# EAGLE design CPU Board (EAGLE 8.0.1)
CNAME: SO-DIMM CPU Module; CREVISION: V1; DESIGNER: Henrik K. B. Jensen
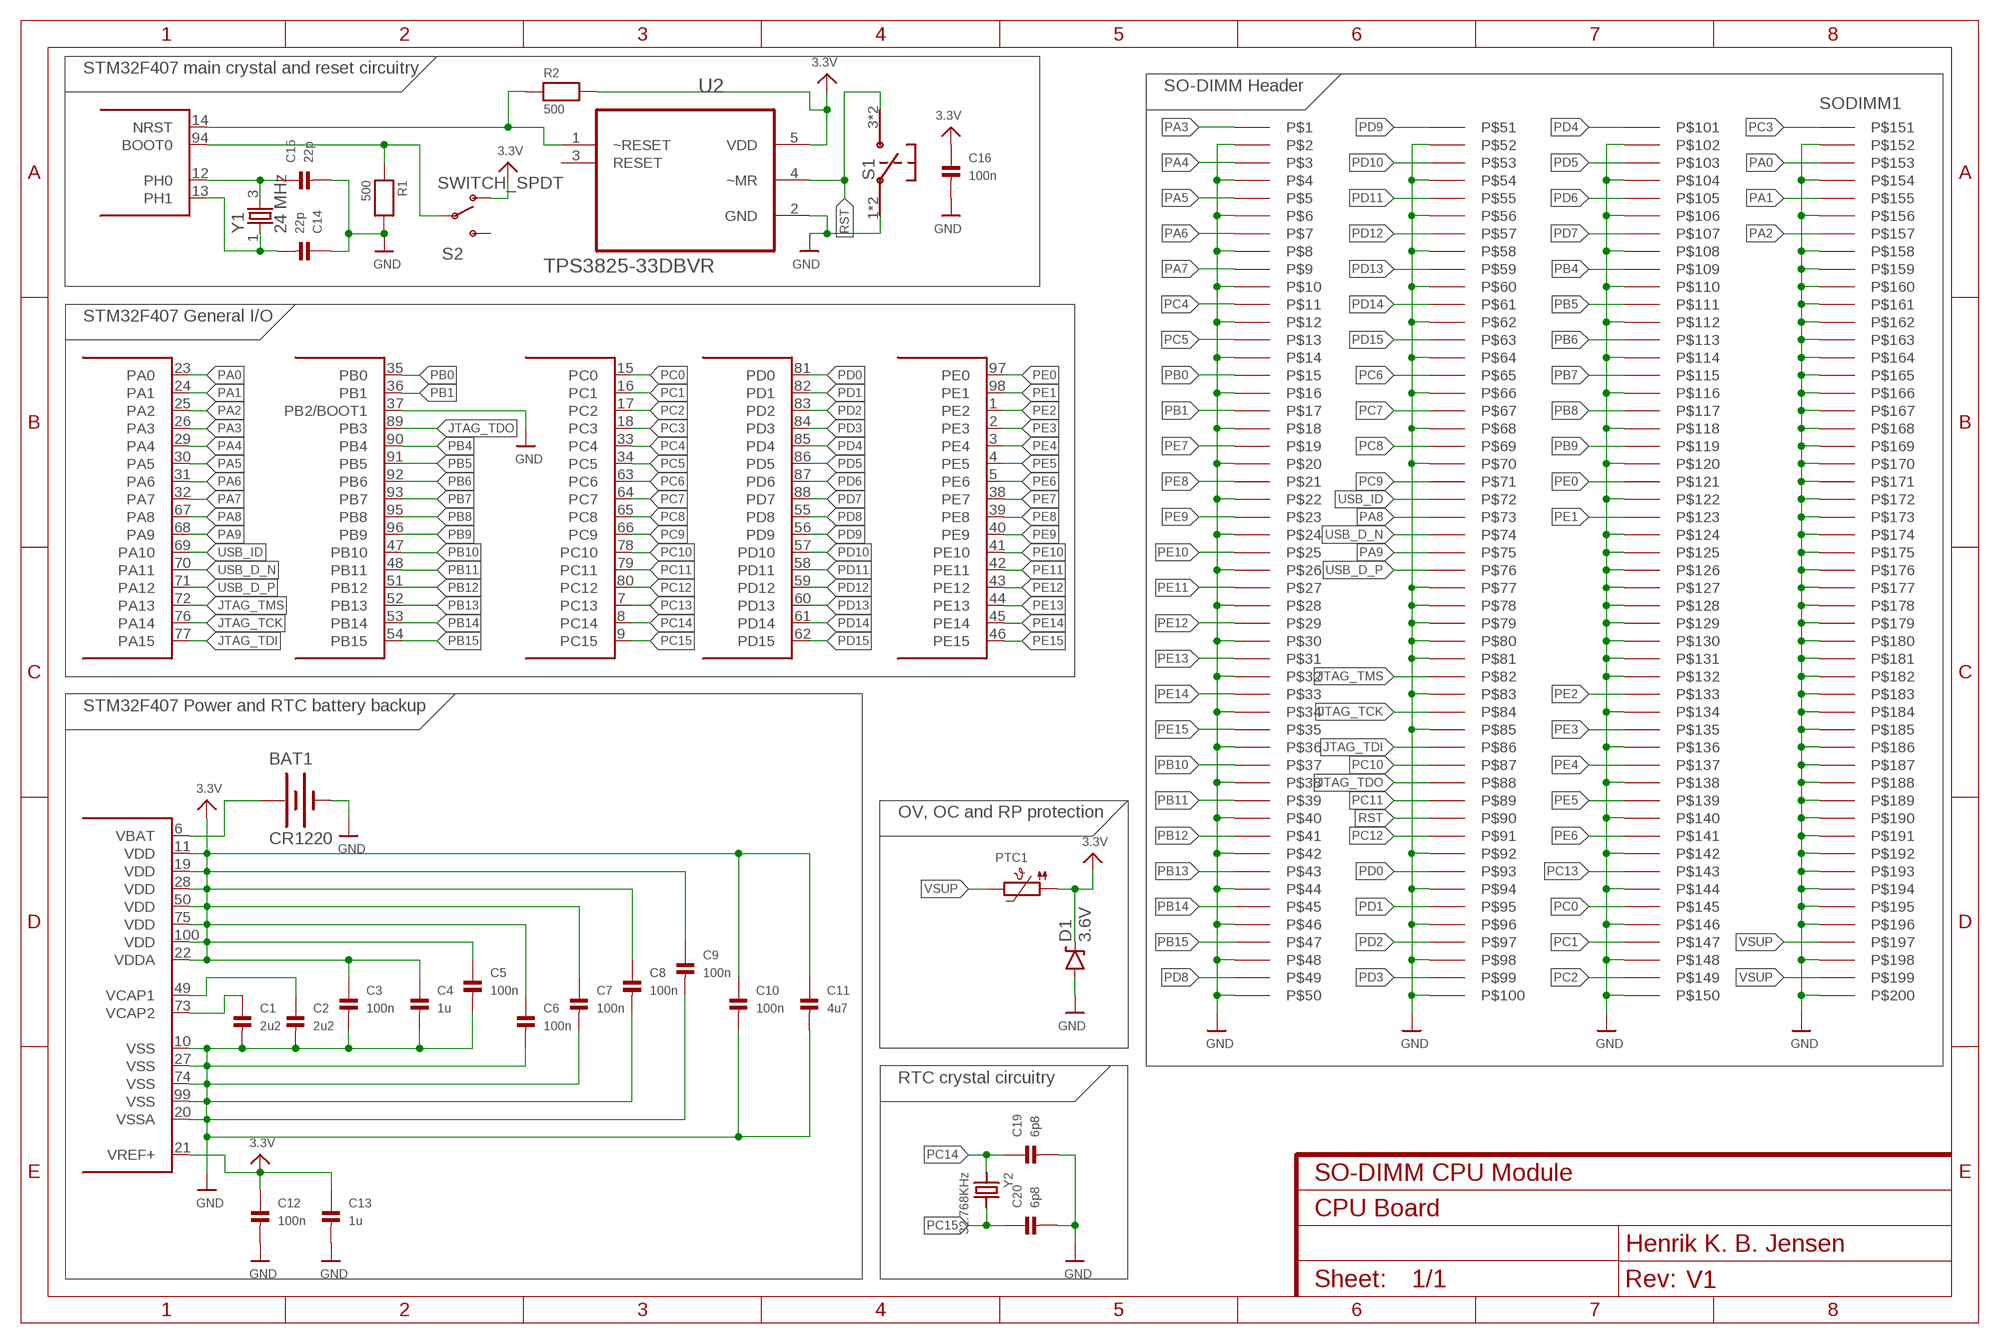
[diagram p0: schematic, sheet 1]

## Parts
BAT1  CR1220  BATTERY12PTH  [BATTCON_12MM_PTH]
C1  2u2  CAP_CERAMIC_0603  [_0603]
C2  2u2  CAP_CERAMIC_0603  [_0603]
C3  100n  CAP_CERAMIC_0603  [_0603]
C4  1u  CAP_CERAMIC_0603  [_0603]
C5  100n  CAP_CERAMIC_0603  [_0603]
C6  100n  CAP_CERAMIC_0603  [_0603]
C7  100n  CAP_CERAMIC_0603  [_0603]
C8  100n  CAP_CERAMIC_0603  [_0603]
C9  100n  CAP_CERAMIC_0603  [_0603]
C10  100n  CAP_CERAMIC_0603  [_0603]
C11  4u7  CAP_CERAMIC_0603  [_0603]
C12  100n  CAP_CERAMIC_0603  [_0603]
C13  1u  CAP_CERAMIC_0603  [_0603]
C14  22p  CAP_CERAMIC_0603  [_0603]
C15  22p  CAP_CERAMIC_0603  [_0603]
C16  100n  CAP_CERAMIC_0603  [_0603]
C19  6p8  CAP_CERAMIC_0603  [_0603]
C20  6p8  CAP_CERAMIC_0603  [_0603]
D1  3.6V  DIODE-ZENER3.3V  [SOD-323]
PTC1  PTC1206  [1206]
R1  500  RESISTOR_0603  [_0603]
R2  500  RESISTOR_0603  [_0603]
S1  PTS645SM43SMTR92  [PTS645]
S2  SWITCH_SPDT  [KPS-1290]
SODIMM1  SODIMM_BOARDSMALL  [SODIMM_BOARD_SMALLER-67.6X35]
U1  STM32F4-100  [SQFP-S-14X14-100]
U2  TPS3825-33DBVR  [SOT95P280X145-5N]
Y1  24 MHz  CRYSTAL4PIN  [CRYSTAL-4PIN]
Y2  32.768KHz  CRYSTAL32.768  [CRYSTAL_CYL_2X6MM_SMT]

## Nets
3.3V: C3.1 C4.1 C5.1 C6.1 C7.1 C8.1 C9.1 C10.1 C11.1 C12.1 C13.1 C16.1 D1.C PTC1.1 R2.2 S2.O U1.11(VDD) U1.19(VDD) U1.21(VREF+) U1.22(VDDA) U1.28(VDD) U1.50(VDD) U1.75(VDD) U1.100(VDD) U2.5(VDD)
GND: BAT1.GND(-) C1.2 C2.2 C3.2 C4.2 C5.2 C6.2 C7.2 C8.2 C9.2 C10.2 C11.2 C12.2 C13.2 C14.1 C15.2 C16.2 C19.2 C20.2 D1.A R1.2 S1.1 S1.2 SODIMM1.2 SODIMM1.4 SODIMM1.6 SODIMM1.8 SODIMM1.10 SODIMM1.12 SODIMM1.14 SODIMM1.16 SODIMM1.18 SODIMM1.20 SODIMM1.22 SODIMM1.24 SODIMM1.26 SODIMM1.28 SODIMM1.30 SODIMM1.32 SODIMM1.34 SODIMM1.36 SODIMM1.38 SODIMM1.40 SODIMM1.42 SODIMM1.44 SODIMM1.46 SODIMM1.48 SODIMM1.50 SODIMM1.52 SODIMM1.54 SODIMM1.56 SODIMM1.58 SODIMM1.60 SODIMM1.62 SODIMM1.64 SODIMM1.66 SODIMM1.68 SODIMM1.70 SODIMM1.77 SODIMM1.78 SODIMM1.79 SODIMM1.80 SODIMM1.81 SODIMM1.83 SODIMM1.85 SODIMM1.92 SODIMM1.94 SODIMM1.96 SODIMM1.98 SODIMM1.100 SODIMM1.102 SODIMM1.104 SODIMM1.106 SODIMM1.108 SODIMM1.110 SODIMM1.112 SODIMM1.114 SODIMM1.116 SODIMM1.118 SODIMM1.120 SODIMM1.122 SODIMM1.124 SODIMM1.125 SODIMM1.126 SODIMM1.127 SODIMM1.128 SODIMM1.129 SODIMM1.130 SODIMM1.131 SODIMM1.132 SODIMM1.134 SODIMM1.136 SODIMM1.138 SODIMM1.140 SODIMM1.142 SODIMM1.144 SODIMM1.146 SODIMM1.148 SODIMM1.150 SODIMM1.152 SODIMM1.154 SODIMM1.156 SODIMM1.158 SODIMM1.159 SODIMM1.160 SODIMM1.161 SODIMM1.162 SODIMM1.163 SODIMM1.164 SODIMM1.165 SODIMM1.166 SODIMM1.167 SODIMM1.168 SODIMM1.169 SODIMM1.170 SODIMM1.171 SODIMM1.172 SODIMM1.173 SODIMM1.174 SODIMM1.175 SODIMM1.176 SODIMM1.177 SODIMM1.178 SODIMM1.179 SODIMM1.180 SODIMM1.181 SODIMM1.182 SODIMM1.183 SODIMM1.184 SODIMM1.185 SODIMM1.186 SODIMM1.187 SODIMM1.188 SODIMM1.189 SODIMM1.190 SODIMM1.191 SODIMM1.192 SODIMM1.193 SODIMM1.194 SODIMM1.195 SODIMM1.196 SODIMM1.198 SODIMM1.200 U1.10(VSS) U1.20(VSSA) U1.27(VSS) U1.37(PB2/BOOT1) U1.74(VSS) U1.99(VSS) U2.2(GND)
JTAG_TCK: SODIMM1.84 U1.76(PA14)
JTAG_TDI: SODIMM1.86 U1.77(PA15)
JTAG_TDO: SODIMM1.88 U1.89(PB3)
JTAG_TMS: SODIMM1.82 U1.72(PA13)
N$1: C15.1 U1.12(PH0) Y1.3
N$2: C1.1 U1.73(VCAP2)
N$3: C2.1 U1.49(VCAP1)
N$4: R1.1 S2.P U1.94(BOOT0)
N$6: BAT1.VCC@1(+) U1.6(VBAT)
N$11: C14.2 U1.13(PH1) Y1.1
PA0: SODIMM1.153 U1.23(PA0)
PA1: SODIMM1.155 U1.24(PA1)
PA2: SODIMM1.157 U1.25(PA2)
PA3: SODIMM1.1 U1.26(PA3)
PA4: SODIMM1.3 U1.29(PA4)
PA5: SODIMM1.5 U1.30(PA5)
PA6: SODIMM1.7 U1.31(PA6)
PA7: SODIMM1.9 U1.32(PA7)
PA8: SODIMM1.73 U1.67(PA8)
PA9: SODIMM1.75 U1.68(PA9)
PB0: SODIMM1.15 U1.35(PB0)
PB1: SODIMM1.17 U1.36(PB1)
PB4: SODIMM1.109 U1.90(PB4)
PB5: SODIMM1.111 U1.91(PB5)
PB6: SODIMM1.113 U1.92(PB6)
PB7: SODIMM1.115 U1.93(PB7)
PB8: SODIMM1.117 U1.95(PB8)
PB9: SODIMM1.119 U1.96(PB9)
PB10: SODIMM1.37 U1.47(PB10)
PB11: SODIMM1.39 U1.48(PB11)
PB12: SODIMM1.41 U1.51(PB12)
PB13: SODIMM1.43 U1.52(PB13)
PB14: SODIMM1.45 U1.53(PB14)
PB15: SODIMM1.47 U1.54(PB15)
PC0: SODIMM1.145 U1.15(PC0)
PC1: SODIMM1.147 U1.16(PC1)
PC2: SODIMM1.149 U1.17(PC2)
PC3: SODIMM1.151 U1.18(PC3)
PC4: SODIMM1.11 U1.33(PC4)
PC5: SODIMM1.13 U1.34(PC5)
PC6: SODIMM1.65 U1.63(PC6)
PC7: SODIMM1.67 U1.64(PC7)
PC8: SODIMM1.69 U1.65(PC8)
PC9: SODIMM1.71 U1.66(PC9)
PC10: SODIMM1.87 U1.78(PC10)
PC11: SODIMM1.89 U1.79(PC11)
PC12: SODIMM1.91 U1.80(PC12)
PC13: SODIMM1.143 U1.7(PC13)
PC14: C19.1 U1.8(PC14) Y2.1
PC15: C20.1 U1.9(PC15) Y2.2
PD0: SODIMM1.93 U1.81(PD0)
PD1: SODIMM1.95 U1.82(PD1)
PD2: SODIMM1.97 U1.83(PD2)
PD3: SODIMM1.99 U1.84(PD3)
PD4: SODIMM1.101 U1.85(PD4)
PD5: SODIMM1.103 U1.86(PD5)
PD6: SODIMM1.105 U1.87(PD6)
PD7: SODIMM1.107 U1.88(PD7)
PD8: SODIMM1.49 U1.55(PD8)
PD9: SODIMM1.51 U1.56(PD9)
PD10: SODIMM1.53 U1.57(PD10)
PD11: SODIMM1.55 U1.58(PD11)
PD12: SODIMM1.57 U1.59(PD12)
PD13: SODIMM1.59 U1.60(PD13)
PD14: SODIMM1.61 U1.61(PD14)
PD15: SODIMM1.63 U1.62(PD15)
PE0: SODIMM1.121 U1.97(PE0)
PE1: SODIMM1.123 U1.98(PE1)
PE2: SODIMM1.133 U1.1(PE2)
PE3: SODIMM1.135 U1.2(PE3)
PE4: SODIMM1.137 U1.3(PE4)
PE5: SODIMM1.139 U1.4(PE5)
PE6: SODIMM1.141 U1.5(PE6)
PE7: SODIMM1.19 U1.38(PE7)
PE8: SODIMM1.21 U1.39(PE8)
PE9: SODIMM1.23 U1.40(PE9)
PE10: SODIMM1.25 U1.41(PE10)
PE11: SODIMM1.27 U1.42(PE11)
PE12: SODIMM1.29 U1.43(PE12)
PE13: SODIMM1.31 U1.44(PE13)
PE14: SODIMM1.33 U1.45(PE14)
PE15: SODIMM1.35 U1.46(PE15)
RESET: R2.1 U1.14(NRST) U2.1(~RESET)
RST: S1.3 S1.4 SODIMM1.90 U2.4(~MR)
USB_D_N: SODIMM1.74 U1.70(PA11)
USB_D_P: SODIMM1.76 U1.71(PA12)
USB_ID: SODIMM1.72 U1.69(PA10)
VSUP: PTC1.2 SODIMM1.197 SODIMM1.199
Unconnected: S2.S U2.3(RESET)

## Notes on the sheet
- STM32F407 main crystal and reset circuitry
- SO-DIMM Header
- STM32F407 General I/O
- STM32F407 Power and RTC battery backup
- OV, OC and RP protection
- RTC crystal circuitry

## Library data of the parts
BAT1 = SparkFun-Electromechanical:BATTERY: Battery Holders Various common sizes : AA, AAA, 18650 (PRT-12895), 20mm coin cell and 12mm coin cell. 20MM_4LEGS, BATT-10373; PROD_ID: BATT-08315
C1-C16 C19 C20 = microbuilder:CAP_CERAMIC: Ceramic Capacitors 0402 - 0402 Surface Mount Capacitors 16pF 50V 5% [Digikey: 445-4899-2-ND] 18pF 50V 5% [Digikey: 490-1281-2-ND] 22pF 50V 5% [Digikey: 490-1283-2-ND] 68pF 50V 5% [Digikey: 490-1289-2-ND] 0.1uF 10V 10% [Digikey: 490-1318-2-ND] 1.0uF 6.3V 10% [Digikey: 490-1320-2-ND] 0603 - 0603 Surface Mount Capacitors 16 pF 50V 5% [Digikey: 445-5051-2-ND] 22 pF 50V [Digikey: PCC220ACVTR-ND] 33 pF 50V 5% [Digikey: 490-1415-1-ND] 56pF 50V 5% [Digikey: 490-1421-1-ND] 220pF 50V 5% [Digikey: 445-1285-1-ND] 680 pF 50V 2200 pF 50V 5% C0G [Digikey: 445-1297-1-ND] 5600 pF 100V 5% X7R [Digikey: 478-3711-1-ND] 0.1 µF 25V 10% [Digikey: PCC2277TR-ND] 0.22 µF 16V 10% X7R [Digikey: 445-1318-1-ND] 1.0 µF 25V 10% [Digikey: 445-5146-2-ND] 0603 - RF Specific 3pF 250V +/-0.1pF RF [Digikey: 712-1347-1-ND] 18 pF 250V 5% [Digikey: 478-3505-1-ND or 712-1322-1-ND] 56 pF 250V 5% C0G RF [Digikey: 490-4867-1-ND] 68 pF 250V RF [Digikey: 490-4868-1-ND] 0805 - 0805 Surface Mount Capacitors 220 pF 250V 2% RF Ceramic Capacitor [Digikey: 712-1398-1-ND] 1000 pF 50V 2% NP0 Ceramic Capacitor [Digikey: 478-3760-1-ND] 0.1 µF 25V 10% Ceramic Capacitor [Digikey: PCC1828TR-ND] 1.0 µF 16V 10% Ceramic Capacitor[Digikey: 490-1691-2-ND] 10.0 µF 10V 10% Ceramic Capacitor[Digikey: 709-1228-1-ND] 10.0 uF 16V 10% Ceramic Capacitor [Digikey: 478-5165-2-ND] 47 uF 6.3V 20% Ceramic Capacitor [Digikey: 587-1779-1-ND or 399-5506-1-ND] 1206 - 1206 Surface Mount Capacitors 47uF 10V 20% Ceramic Capacitor [Digikey: 490-5528-1-ND or 399-5508-1-ND or 445-6010-1-ND] 100uF 6.3V -20%, +80% Y5V Ceramic Capacitor (Digikey: 490-4512-1-ND, Mouser: 81-GRM31CF50J107ZE1L)
D1 = SparkFun-DiscreteSemi:DIODE-ZENER: Zener Diode Production Part - 8199 3.4V Zener Voltage; PROD_ID: DIO-11284; VALUE: 3.3V
PTC1 = microbuilder:PTC: PTC (Resettable Fuse) 1206 Package 250mA PTC (16V Max, Time-to-Trip: 0.08s) - Digikey: F2110CT-ND 1210 Package 100mA PTC (30V Max, Time-to-Trip: 0.6s) - Digikey: MF-USMF010-2CT-ND 1812 Package 750mA PTC (24V Max, Time-to-Trip: 0.2s) - Digikey: MF-MSMF075/24-2CT-ND
R1 R2 = microbuilder:RESISTOR: Resistors 0402 - 0402 Surface Mount Package 22 Ohm 1% 1/16W [Digikey: 311-22.0LRTR-ND] 33 Ohm 5% 1/16W 1.0K 5% 1/16W 1.5K 5% 1/16W 2.0K 1% 1/16W 10.0K 1% 1/16W [Digikey: 311-10.0KLRTR-ND] 10.0K 5% 1/16W [Digikey: RMCF0402JT10K0TR-ND] 12.1K 1% 1/16W [Digikey: 311-22.0LRTR-ND] 100.0K 5% 1/16W 0603 - 0603 Surface Mount Package 0 Ohm 1/10 Watt 1% Resistor 15 Ohm 1/10 Watt 1% Resistor 33 Ohm 1/10 Watt 1% Resistor 49.9 Ohm 1/10 Watt 1% Resistor 100 Ohm 1/10 Watt 1% Resistor 150 Ohm 1/10 Watt 1% Resistor 240 Ohm 1/10 Watt 1% Resistor 390 Ohm 1/10 Watt 1% Resistor 560 Ohm 1/10 Watt 1% Resistor 680 Ohm 1/10 Watt 1% Resistor 750 Ohm 1/10 Watt 1% Resistor 1.0K Ohm 1/10 Watt 1% Resistor 1.5K Ohm 1/10 Watt 1% Resistor 2.0K Ohm 1/10 Watt 1% Resistor 2.2K Ohm 1/10 Watt 1% Resistor 3.3K Ohm 1/10 Watt 1% Resistor 4.7K Ohm 1/10 Watt 1% Resistor 10.0K Ohm 1/10 Watt 1% Resistor 12.0K Ohm 1/10 Watt 1% Resistor 12.1K Ohm 1/10 Watt 1% Resistor 20.0K Ohm 1/10 Watt 1% Resistor 33.0K Ohm 1/10 Watt 1% Resistor 100.0K Ohm 1/10 Watt 1% Resistor 0805 - 0805 Surface Mount Package 0 Ohm 1/8 Watt 1% Resistor 33 Ohm 1/8 Watt 1% Resistor 100 Ohm 1/8 Watt 1% Resistor 150 Ohm 1/8 Watt 1% Resistor 200 Ohm 1/8 Watt 1% Resistor 240 Ohm 1/8 Watt 1% Resistor 330 Ohm 1/8 Watt 1% Resistor 390 Ohm 1/8 Watt 1% Resistor 470 Ohm 1/8 Watt 1% Resistor 1.0K Ohm 1/8 Watt 1% Resistor 1.5K Ohm 1/8 Watt 1% Resistor 2.0K Ohm 1/8 Watt 1% Resistor 4.7K Ohm 1/8 Watt 1% Resistor 5.1K Ohm 1/8 Watt 1% Resistor 5.6K Ohm 1/8 Watt 1% Resistor 10.0K Ohm 1/8 Watt 1% Resistor 22.0K Ohm 1/8 Watt 1% Resistor 33.0K Ohm 1/8 Watt 1% Resistor 100K Ohm 1/8 Watt 1% Resistor 1206 - 1206 Surface Mount Package 2012 - 2010 Surface Mount Package 0.11 Ohm 1/2 Watt 1% Resistor - Digikey: RHM.11UCT-ND
S1 = switches:PTS645SM43SMTR92: Tactile Switch SPST-NO Top Actuated Surface Mount; DIGIKEY: CKN9112CT-ND
S2 = SparkFun-Electromechanical:SWITCH_SPDT: SWCH-10651 Side-actuated SPDT slide switch, as used on the Arduino Pro; PROD_ID: SWCH-10651
SODIMM1 = BaseApp:SODIMM_BOARD: SODIMM BOARD Thickness of board must be 1mm.
U1 = apbteam_stm32:STM32F4-100: STM32F4, 100 pin package According to STM32F40x datasheet, almost compatible with STM32F4xx, STM32F2xx, some pins must be connected differently, see chapter 2.1.
U2 = Texas Instruments_By_element14_Batch_1:TPS3825-33DBVR: PROCESSOR SUPERVISORY CIRCUITS; MPN: TPS3825-33DBVR; OC_FARNELL: 1535758; OC_NEWARK: 77C0425; PACKAGE: SOT-23-5; SUPPLIER: Texas Instruments
Y1 = BaseApp:CRYSTAL: CRYSTAL SMD-10.5X4.8-2PIN :- http://www.digikey.com/product-detail/en/CX49GFNB12000H0PESZZ/478-4349-1-ND/1532102 SMD-5X3- 4PIN :- 535-11281-1-ND
Y2 = microbuilder:CRYSTAL: Crystals HC49UP - Surface Mount Crystal 4.0MHz 18pF +/-30ppm Surface Mount Crystal [Digikey: 535-9857-1-ND] 12.0 MHz Surface Mount Crystal [Digikey: 535-9869-6-ND] 25.0 MHz Surface Mount Crystal [Digikey: 535-9078-1-ND] 2.5 x 2.0mm - MEMs SMT Crystal 16.0 MHz 10pF 20ppm 2.5 x 2.0mm Crystal [Digikey -40-85°C: 535-10923-1-ND] 3.2 x 2.5mm - MEMs SMT Crystal 12.0 MHz 8pF 15ppm 3.2 x 2.5mm Crystal [Digikey: -10-70°C: 644-1047-1-ND -40-125°C: 644-1128-1-ND] 16.0 MHz 8pF 15ppm 3.2 x 2.5mm Crystal [Digikey: -10-70°C: 644-1049-1-ND -40-125°C: 644-1129-2-ND] 16.0 MHz 10pF 10ppm 3.2 x 2.5mm Crystal [Digikey: 644-1100-1-ND] 27.12 MHz 18pF 30ppm 3.2 x 2.5mm Crystal [Digikey: 887-1424-1-ND] 27.12MHz 10pF 10ppm 3.2 x 2.5mm Crystal [Digikey: 887-1329-1-ND] 4.9 x 1.8mm - MEMs SMT Crystal 32.768 KHz 12.5pF 20ppm 4.9 x 1.8mm Crystal [Digikey: SE2415CT-ND] 8.0 x 3.8mm - Surface Mount Crystal 32.768kHz 12.5pF 20ppm -40°C-85°C [Digikey: 535-9166-2-ND] Cylinder 32.768KHz Cylinder Crystal (2x6mm body) [Ex. Digikey: 300-8341-2-ND]

## Board
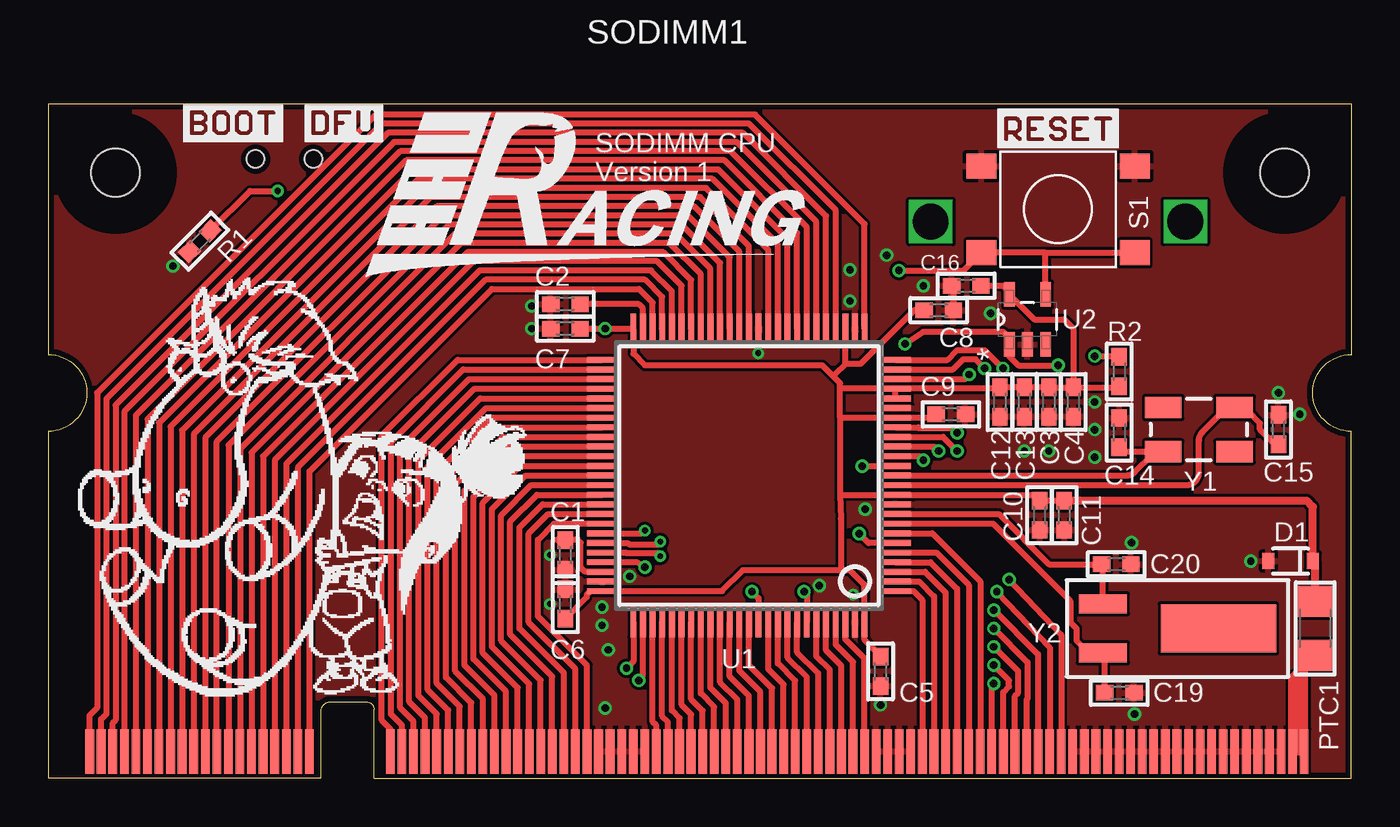
[diagram p1: board, top side]
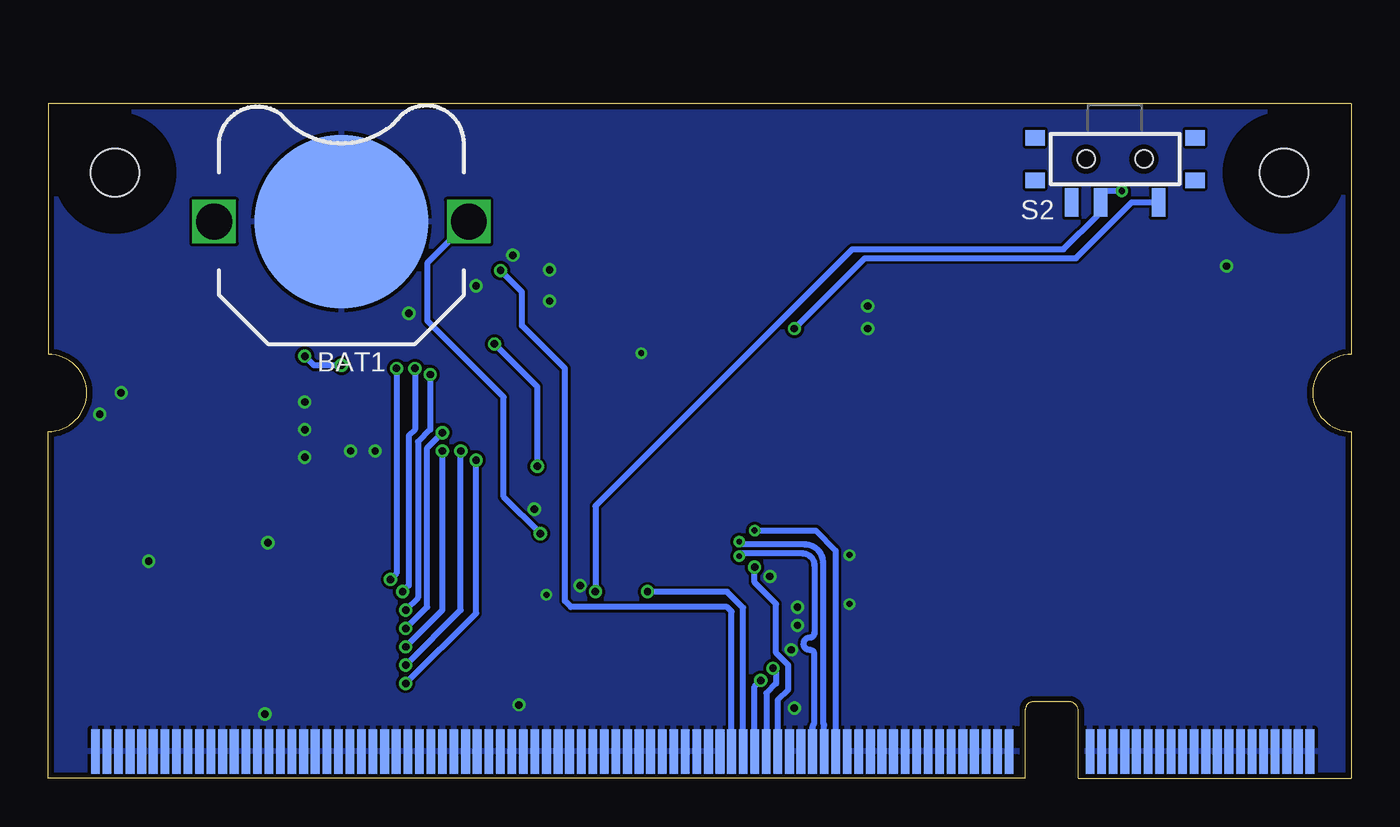
[diagram p2: board, bottom side, seen from below]

Size 67.6 x 35 mm. Coordinates in mm from the lower left corner, seen from the top.
Copper layers (1*16): Top 0.035mm / dielectric 1.5mm / Bottom 0.035mm
Design rules "PCB-POOL Standard": minimum track width 0.15mm, minimum drill 0.3mm, track to track 0.15mm, track to pad 0.15mm, pad to pad 0.15mm, via to via 0.15mm, smd to smd 0.15mm, copper to edge 0.3mm, drill to drill 0.2mm, minimum pad ring 0.2mm, minimum via ring 0.15mm, stop-mask expansion 0.075mm, vias tented up to drill 0mil, thermal gap 0.2mm
Holes 2.5 mm at 3.49,31.43 64.14,31.43
tKeepout: area 0.5,28.4 to 6.5,34.4; area 61.1,28.4 to 67.2,34.4
bKeepout: area 0.5,28.4 to 6.5,34.4; area 61.1,28.4 to 67.2,34.4
tRestrict: area 0.5,28.4 to 6.5,34.5; area 61.1,28.4 to 67.2,34.5
bRestrict: area 0.5,28.4 to 6.5,34.5; area 61.1,28.4 to 67.2,34.5

### Footprints (pad centres in the part's own frame; a part is rotated, then mirrored left to right if it is on the bottom)
BATTCON_12MM_PTH = smd 9 x 9: GND 0,0 | drill 1.854 square: VCC@1 6.604,0; VCC@2 -6.604,0
_0603 = smd 0.9 x 0.8: 1 -0.762,0; 2 0.762,0
SOD-323 = smd 0.63 x 0.83: A 1.15,0; C -1.15,0
1206 = smd 1.6 x 1.8: 1 -1.4,0; 2 1.4,0
PTS645 = smd 1.55 x 1.3: 1 -3.975,2.25; 2 3.975,2.25; 3 3.975,-2.25; 4 -3.975,-2.25
KPS-1290 = smd 0.7 x 1.5: O -2.25,2.25; P 0.75,2.25; S 2.25,2.25 | smd 1 x 0.8: P$1 -4.15,1.1; P$2 -4.15,-1.1; P$3 4.15,-1.1; P$4 4.15,1.1 | hole 0.9: -1.5,0; 1.5,0
SODIMM_BOARD_SMALLER-67.6X35 = smd 0.45 x 2.3: 1 2.15,1.4; 3 2.75,1.4; 5 3.35,1.4; 7 3.95,1.4; 9 4.55,1.4; 11 5.15,1.4; 13 5.75,1.4; 15 6.35,1.4; 17 6.95,1.4; 19 7.55,1.4; 21 8.15,1.4; 23 8.75,1.4; 25 9.35,1.4; 27 9.95,1.4; 29 10.55,1.4; 31 11.15,1.4; 33 11.75,1.4; 35 12.35,1.4; 37 12.95,1.4; 39 13.55,1.4; 41 17.75,1.4; 43 18.35,1.4; 45 18.95,1.4; 47 19.55,1.4; 49 20.15,1.4; 51 20.75,1.4; 53 21.35,1.4; 55 21.95,1.4; 57 22.55,1.4; 59 23.15,1.4; 61 23.75,1.4; 63 24.35,1.4; 65 24.95,1.4; 67 25.55,1.4; 69 26.15,1.4; 71 26.75,1.4; 73 27.35,1.4; 75 27.95,1.4; 77 28.55,1.4; 79 29.15,1.4; 81 29.75,1.4; 83 30.35,1.4; 85 30.95,1.4; 87 31.55,1.4; 89 32.15,1.4; 91 32.75,1.4; 93 33.35,1.4; 95 33.95,1.4; 97 34.55,1.4; 99 35.15,1.4; 101 35.75,1.4; 103 36.35,1.4; 105 36.95,1.4; 107 37.55,1.4; 109 38.15,1.4; 111 38.75,1.4; 113 39.35,1.4; 115 39.95,1.4; 117 40.55,1.4; 119 41.15,1.4; 121 41.75,1.4; 123 42.35,1.4; 125 42.95,1.4; 127 43.55,1.4; 129 44.15,1.4; 131 44.75,1.4; 133 45.35,1.4; 135 45.95,1.4; 137 46.55,1.4; 139 47.15,1.4; 141 47.75,1.4; 143 48.35,1.4; 145 48.95,1.4; 147 49.55,1.4; 149 50.15,1.4; 151 50.75,1.4; 153 51.35,1.4; 155 51.95,1.4; 157 52.55,1.4; 159 53.15,1.4; 161 53.75,1.4; 163 54.35,1.4; 165 54.95,1.4; 167 55.55,1.4; 169 56.15,1.4; 171 56.75,1.4; 173 57.35,1.4; 175 57.95,1.4; 177 58.55,1.4; 179 59.15,1.4; 181 59.75,1.4; 183 60.35,1.4; 185 60.95,1.4; 187 61.55,1.4; 189 62.15,1.4; 191 62.75,1.4; 193 63.35,1.4; 195 63.95,1.4; 197 64.55,1.4; 199 65.15,1.4 | smd 0.45 x 2.3 bottom: 2 2.15,1.4; 4 2.75,1.4; 6 3.35,1.4; 8 3.95,1.4; 10 4.55,1.4; 12 5.15,1.4; 14 5.75,1.4; 16 6.35,1.4; 18 6.95,1.4; 20 7.55,1.4; 22 8.15,1.4; 24 8.75,1.4; 26 9.35,1.4; 28 9.95,1.4; 30 10.55,1.4; 32 11.15,1.4; 34 11.75,1.4; 36 12.35,1.4; 38 12.95,1.4; 40 13.55,1.4; 42 17.75,1.4; 44 18.35,1.4; 46 18.95,1.4; 48 19.55,1.4; 50 20.15,1.4; 52 20.75,1.4; 54 21.35,1.4; 56 21.95,1.4; 58 22.55,1.4; 60 23.15,1.4; 62 23.75,1.4; 64 24.35,1.4; 66 24.95,1.4; 68 25.55,1.4; 70 26.15,1.4; 72 26.75,1.4; 74 27.35,1.4; 76 27.95,1.4; 78 28.55,1.4; 80 29.15,1.4; 82 29.75,1.4; 84 30.35,1.4; 86 30.95,1.4; 88 31.55,1.4; 90 32.15,1.4; 92 32.75,1.4; 94 33.35,1.4; 96 33.95,1.4; 98 34.55,1.4; 100 35.15,1.4; 102 35.75,1.4; 104 36.35,1.4; 106 36.95,1.4; 108 37.55,1.4; 110 38.15,1.4; 112 38.75,1.4; 114 39.35,1.4; 116 39.95,1.4; 118 40.55,1.4; 120 41.15,1.4; 122 41.75,1.4; 124 42.35,1.4; 126 42.95,1.4; 128 43.55,1.4; 130 44.15,1.4; 132 44.75,1.4; 134 45.35,1.4; 136 45.95,1.4; 138 46.55,1.4; 140 47.15,1.4; 142 47.75,1.4; 144 48.35,1.4; 146 48.95,1.4; 148 49.55,1.4; 150 50.15,1.4; 152 50.75,1.4; 154 51.35,1.4; 156 51.95,1.4; 158 52.55,1.4; 160 53.15,1.4; 162 53.75,1.4; 164 54.35,1.4; 166 54.95,1.4; 168 55.55,1.4; 170 56.15,1.4; 172 56.75,1.4; 174 57.35,1.4; 176 57.95,1.4; 178 58.55,1.4; 180 59.15,1.4; 182 59.75,1.4; 184 60.35,1.4; 186 60.95,1.4; 188 61.55,1.4; 190 62.15,1.4; 192 62.75,1.4; 194 63.35,1.4; 196 63.95,1.4; 198 64.55,1.4; 200 65.15,1.4
SQFP-S-14X14-100 = smd 0.3 x 1.6: 1 -6,-7.6; 2 -5.5,-7.6; 3 -5,-7.6; 4 -4.5,-7.6; 5 -4,-7.6; 6 -3.5,-7.6; 7 -3,-7.6; 8 -2.5,-7.6; 9 -2,-7.6; 10 -1.5,-7.6; 11 -1,-7.6; 12 -0.5,-7.6; 13 0,-7.6; 14 0.5,-7.6; 15 1,-7.6; 16 1.5,-7.6; 17 2,-7.6; 18 2.5,-7.6; 19 3,-7.6; 20 3.5,-7.6; 21 4,-7.6; 22 4.5,-7.6; 23 5,-7.6; 24 5.5,-7.6; 25 6,-7.6; 51 6,7.6; 52 5.5,7.6; 53 5,7.6; 54 4.5,7.6; 55 4,7.6; 56 3.5,7.6; 57 3,7.6; 58 2.5,7.6; 59 2,7.6; 60 1.5,7.6; 61 1,7.6; 62 0.5,7.6; 63 0,7.6; 64 -0.5,7.6; 65 -1,7.6; 66 -1.5,7.6; 67 -2,7.6; 68 -2.5,7.6; 69 -3,7.6; 70 -3.5,7.6; 71 -4,7.6; 72 -4.5,7.6; 73 -5,7.6; 74 -5.5,7.6; 75 -6,7.6 | smd 1.6 x 0.3: 26 7.6,-6; 27 7.6,-5.5; 28 7.6,-5; 29 7.6,-4.5; 30 7.6,-4; 31 7.6,-3.5; 32 7.6,-3; 33 7.6,-2.5; 34 7.6,-2; 35 7.6,-1.5; 36 7.6,-1; 37 7.6,-0.5; 38 7.6,0; 39 7.6,0.5; 40 7.6,1; 41 7.6,1.5; 42 7.6,2; 43 7.6,2.5; 44 7.6,3; 45 7.6,3.5; 46 7.6,4; 47 7.6,4.5; 48 7.6,5; 49 7.6,5.5; 50 7.6,6; 76 -7.6,6; 77 -7.6,5.5; 78 -7.6,5; 79 -7.6,4.5; 80 -7.6,4; 81 -7.6,3.5; 82 -7.6,3; 83 -7.6,2.5; 84 -7.6,2; 85 -7.6,1.5; 86 -7.6,1; 87 -7.6,0.5; 88 -7.6,0; 89 -7.6,-0.5; 90 -7.6,-1; 91 -7.6,-1.5; 92 -7.6,-2; 93 -7.6,-2.5; 94 -7.6,-3; 95 -7.6,-3.5; 96 -7.6,-4; 97 -7.6,-4.5; 98 -7.6,-5; 99 -7.6,-5.5; 100 -7.6,-6
SOT95P280X145-5N = smd 1.27 x 0.559: 1 -1.295,0.94; 2 -1.295,0; 3 -1.295,-0.94; 4 1.295,-0.94; 5 1.295,0.94
CRYSTAL-4PIN = smd 1.9 x 1.1: 1 -1.85,-1.15; 2 1.85,-1.15; 3 1.85,1.15; 4 -1.85,1.15
CRYSTAL_CYL_2X6MM_SMT = smd 2.5 x 1: 1 2.125,1.27; 2 2.125,-1.27 | smd 6 x 2.5: CYLINDER -3.875,0

### Placement (x,y rotation side)
BAT1  52.39,28.89 0 bottom
C1  26.83,11.59 270 top
C2  26.83,24.61 180 top
C3  51.91,19.53 270 top
C4  53.18,19.53 270 top
C5  43.18,5.56 270 top
C6  26.83,9.05 90 top
C7  26.83,23.34 180 top
C8  46.2,24.29 0 top
C9  46.83,18.89 0 top
C10  51.44,13.65 270 top
C11  52.7,13.65 270 top
C12  49.37,19.53 270 top
C13  50.64,19.53 270 top
C14  55.56,17.94 270 top
C15  63.82,18.1 90 top
C16  47.62,25.56 180 top
C19  55.56,4.45 0 top
C20  55.4,11.11 0 top
D1  64.45,11.27 180 top
PTC1  65.72,7.78 270 top
R1  7.87,27.87 225 top
R2  55.56,21.11 270 top
S1  52.39,29.53 0 top
S2  12.26,32.14 180 bottom
SODIMM1  0,0 0 top
U1  36.35,15.72 90 top
U2  50.8,23.81 90 top
Y1  59.69,18.1 0 top
Y2  56.83,7.78 180 top

### Tracks (layer width: path | path; a pad name or v marks a point on that pad's centre or on a via)
3.3V  (via drill 0.38)
  Top 0.305: 41.08,18.72 41.08,20.22 | 41.08,18.72 41.08,14.72 | 41.08,20.22 41.08,20.51 40.8,20.8 | 41.35,21.51 U1.28 | U1.22 41.08,20.22 | U1.21 U1.22 | 41.08,18.72 U1.19 45.89,18.72 C9.1 | 41.08,14.72 U1.11 51.13,14.72 C10.1 C11.1 | C4.1 C3.1 C13.1 C12.1 49.62,20.22 U1.22 | C7.1 v28.89,23.34 30.33,23.34 U1.50 30.35,22.03 30.96,21.43 40.16,21.43 40.8,20.8 | C8.1 44.93,24.29 42.15,21.51 41.35,21.51 | C6.1 27.94,9.4 27.94,9.53 28.13,9.72 U1.75 34.96,9.72 36.04,10.79 41.12,10.79 | C5.1 43.21,6.32 42.35,7.18 U1.100 42.35,10.03 41.59,10.79 41.12,10.79 | 41.08,14.72 41.12,13.48 41.12,10.79 | 41.35,21.51 40.8,20.96 40.8,20.8 | C4.1 53.18,23.34 52.7,23.81 51.16,23.81 U2.5 49.86,25.23 49.53,25.56 C16.1 | C4.1 55.5,20.29 R2.2
  Top 0.406: C11.1 65.28,14.41 65.6,14.09 D1.C 65.72,11.15 PTC1.1
  Bottom 0.305: 10.01,30 S2.O 11.39,29.89 14.29,26.99 25.24,26.99 v28.89,23.34
GND  (via drill 0.3, 0.38)
  Top 0.305: C16.2 46.96,25.46 C8.2
  other vias: 43.18,3.81 41.75,9.53 41.59,24.77 41.59,26.38 25.08,24.5 25.08,23.34 36.83,22.07 26.04,11.59 26.04,9.05 30.16,10.48 42.39,13.97 48.9,24.13 45.4,25.56 6.48,26.58 43.5,27.15 50.64,16.99 51.91,16.99 54.29,19.53 54.29,18.1 54.29,16.67 63.82,20 64.93,18.89 62.39,11.27 56.2,12.22 56.36,3.33 40.01,10 28.73,8.89 28.73,7.94 29.05,6.67 28.89,3.65
  pour Top: 0,0 67.63,0 67.63,34.92 0,34.92
  pour Bottom: 0,0 67.63,0 67.63,34.92 0,34.92
JTAG_TCK  (via drill 0.38)
  Top 0.305: U1.76 30.35,6.07 v30,5.71
  Bottom 0.305: v30,5.71 29.84,5.56 29.84,4.92 30.35,4.42 SODIMM1.84
JTAG_TDI  (via drill 0.38)
  Top 0.305: v30.64,5.08 30.85,5.29 U1.77
  Bottom 0.305: SODIMM1.86 30.95,4.77 v30.64,5.08
JTAG_TDO  (via drill 0.38)
  Top 0.305: v36.51,9.68 36.85,9.34 U1.89
  Bottom 0.305: SODIMM1.88 31.55,8.85 32.38,9.68 v36.51,9.68
JTAG_TMS  (via drill 0.38)
  Top 0.305: v30.96,10.95 30.54,11.22 U1.72
  Bottom 0.305: SODIMM1.82 29.75,4.06 29.21,4.6 29.21,5.87 29.84,6.51 29.84,9.05 30.96,10.16 v30.96,10.95
N$1
  Top 0.305: C15.1 63.63,17.34 62.87,18.1 62.87,18.41 62.23,19.05 61.74,19.05 Y1.3 61.42,19.25 arc45 60.97,19.06 59.88,17.97 arc45 59.69,17.52 59.69,15.85 arc-90 59.05,15.22 U1.12
N$2
  Top 0.305: U1.73 27.86,10.72 27.62,10.95 27.62,12.22 27.46,12.38 26.38,12.38 C1.1
N$3
  Top 0.305: U1.49 30.85,24.39 30.64,24.61 C2.1
N$4  (via drill 0.33, 0.38)
  Top 0.305: v39.21,9.68 39.35,9.54 U1.94 | R1.1 10.47,30.48 v11.91,30.48
  Bottom 0.305: v39.21,9.68 39.21,14.13 25.88,27.46 14.93,27.46 13.18,29.21 13.18,29.72 S2.P | S2.P 13.01,30.17 | S2.P 13.01,30.48 v11.91,30.48 | 13.01,29.54 S2.P
N$6  (via drill 0.38)
  Top 0.305: U1.6 42.55,12.22 v42.07,12.7
  Bottom 0.305: v42.07,12.7 43.97,14.61 43.97,19.78 47.94,23.75 47.94,26.73 BAT1.VCC@1
N$11
  Top 0.305: C14.2 55.95,16.95 Y1.1 57.69,16.95 arc45 57.24,16.76 56.38,15.9 arc-45 55.93,15.72 U1.13
PA0  (via drill 0.38)
  Top 0.305: U1.23 47.55,20.72 v47.78,20.95 | v49.05,8.73 51.35,6.43 SODIMM1.153
  Bottom 0.305: v47.78,20.95 47.78,18.1 48.42,17.46 48.42,9.37 v49.05,8.73
PA1  (via drill 0.38)
  Top 0.305: U1.24 46.93,21.22 47.47,21.75 48.1,21.75 v48.58,21.27 | v49.21,9.68 51.95,6.79 SODIMM1.155
  Bottom 0.305: v48.58,21.27 48.58,18.1 48.9,17.78 48.9,10 v49.21,9.68
PA2  (via drill 0.38)
  Top 0.305: U1.25 46.64,21.72 47.15,22.23 48.58,22.23 v49.53,21.27 | SODIMM1.157 52.55,7.46 v49.85,10.32
  Bottom 0.305: v49.53,21.27 49.53,10.64 v49.85,10.32
PA3
  Top 0.305: SODIMM1.1 2.15,3.26 2.54,3.65 2.54,20 16.99,34.45 36.67,34.45 42.35,28.77 U1.26
PA4
  Top 0.305: SODIMM1.3 2.75,3.07 3.02,3.33 3.02,19.68 17.3,33.97 36.35,33.97 40.85,29.47 U1.29
PA5
  Top 0.305: SODIMM1.5 3.35,2.87 3.49,3.02 3.49,19.37 17.62,33.5 36.04,33.5 40.35,29.18 U1.30
PA6
  Top 0.305: SODIMM1.7 3.95,19.03 17.94,33.02 35.72,33.02 39.85,28.89 U1.31
PA7
  Top 0.305: SODIMM1.9 4.55,18.84 18.26,32.54 35.4,32.54 39.35,28.59 U1.32
PA8
  Top 0.305: U1.67 25.94,13.72 24.92,12.7 24.92,8.1 27.35,5.67 SODIMM1.73
PA9
  Top 0.305: SODIMM1.75 27.95,5.86 25.4,8.41 25.4,12.38 26.23,13.22 U1.68
PB0
  Top 0.305: SODIMM1.15 6.35,18.26 19.21,31.11 34.45,31.11 37.85,27.71 U1.35
PB1
  Top 0.305: SODIMM1.17 6.95,18.06 19.53,30.64 34.13,30.64 37.35,27.42 U1.36
PB4
  Top 0.305: SODIMM1.109 38.15,4.87 37.35,5.67 U1.90
PB5
  Top 0.305: SODIMM1.111 38.75,5.07 37.85,5.96 U1.91
PB6
  Top 0.305: SODIMM1.113 39.35,5.26 38.35,6.25 U1.92
PB7
  Top 0.305: SODIMM1.115 39.95,5.45 38.85,6.55 U1.93
PB8
  Top 0.305: SODIMM1.117 40.55,5.65 39.85,6.34 U1.95
PB9
  Top 0.305: SODIMM1.119 41.15,5.84 40.35,6.64 U1.96
PB10
  Top 0.305: SODIMM1.37 12.95,16.12 22.7,25.88 30.96,25.88 31.85,24.98 U1.47
PB11
  Top 0.305: U1.48 31.35,24.68 30.64,25.4 23.02,25.4 13.55,15.93 SODIMM1.39
PB12
  Top 0.305: 17.78,1.43 SODIMM1.41 17.75,2.57 17.3,3.02 17.3,17.78 21.24,21.72 U1.51
PB13
  Top 0.305: SODIMM1.43 18.35,2.76 17.78,3.33 17.78,17.46 21.53,21.22 U1.52
PB14
  Top 0.305: SODIMM1.45 18.95,2.96 18.26,3.65 18.26,17.14 21.83,20.72 U1.53
PB15
  Top 0.305: SODIMM1.47 19.55,3.15 18.73,3.97 18.73,16.83 22.12,20.22 U1.54
PC0  (via drill 0.38)
  Top 0.305: U1.15 45.2,16.72 v45.4,16.51 | SODIMM1.145 48.95,4.82 v49.05,4.92
  Bottom 0.305: v49.05,4.92 45.4,8.57 v45.4,16.51
PC1  (via drill 0.38)
  Top 0.305: U1.16 45.97,17.22 v46.2,16.99 | SODIMM1.147 49.55,4.46 49.85,4.76 49.85,5.08 v49.05,5.87
  Bottom 0.305: v49.05,5.87 46.2,8.73 v46.2,16.99
PC2  (via drill 0.38)
  Top 0.305: U1.17 46.42,17.72 v47.15,16.99 | SODIMM1.149 50.15,4.27 50.32,4.45 50.32,5.56 v49.05,6.83
  Bottom 0.305: v49.05,6.83 47.15,8.73 v47.15,16.99
PC3  (via drill 0.38)
  Top 0.305: SODIMM1.151 50.75,4.08 50.8,4.13 50.8,6.03 v49.05,7.78 | U1.18 45.12,18.22 45.16,18.18 46.9,18.19 v47.15,17.94 46.99,18.1
  Bottom 0.305: v47.15,17.94 47.94,17.14 47.94,8.89 v49.05,7.78
PC4
  Top 0.305: SODIMM1.11 5.15,18.64 18.57,32.07 35.08,32.07 38.85,28.3 U1.33
PC5
  Top 0.305: SODIMM1.13 5.75,18.45 18.89,31.59 34.77,31.59 38.35,28 U1.34
PC6
  Top 0.305: SODIMM1.65 24.95,4.89 23.02,6.83 23.02,13.97 24.77,15.72 U1.63
PC7
  Top 0.305: U1.64 25.06,15.22 23.5,13.65 23.5,7.14 25.55,5.09 SODIMM1.67
PC8
  Top 0.305: U1.65 25.35,14.72 23.97,13.34 23.97,7.46 26.15,5.28 SODIMM1.69
PC9
  Top 0.305: U1.66 25.65,14.22 24.45,13.02 24.45,7.78 26.75,5.48 SODIMM1.71
PC10
  Top 0.305: SODIMM1.87 31.55,2.74 31.35,2.94 U1.78
PC11
  Top 0.305: SODIMM1.89 32.15,2.93 31.85,3.23 U1.79
PC12
  Top 0.305: SODIMM1.91 32.75,3.13 32.35,3.52 U1.80
PC13
  Top 0.305: U1.7 45.86,12.72 48.35,10.23 SODIMM1.143
PC14
  Top 0.305: U1.8 49.01,13.22 53.02,9.21 53.02,8.1 53.34,7.78 53.34,7.14 53.98,6.51 Y2.1 54.8,6.42 C19.1
PC15
  Top 0.305: U1.9 49.31,13.72 51.91,11.11 C20.1 54.71,11.05 Y2.2
PD0
  Top 0.305: SODIMM1.93 33.35,3.32 32.85,3.82 U1.81
PD1
  Top 0.305: SODIMM1.95 33.95,3.52 33.35,4.11 U1.82
PD2
  Top 0.305: SODIMM1.97 34.55,3.71 33.85,4.41 U1.83
PD3
  Top 0.305: SODIMM1.99 35.15,3.9 34.35,4.7 U1.84
PD4
  Top 0.305: SODIMM1.101 35.75,4.1 34.85,4.99 U1.85
PD5
  Top 0.305: SODIMM1.103 36.35,4.29 35.35,5.29 U1.86
PD6
  Top 0.305: SODIMM1.105 36.95,4.48 35.85,5.58 U1.87
PD7
  Top 0.305: SODIMM1.107 37.55,4.68 36.35,5.87 U1.88
PD8
  Top 0.305: SODIMM1.49 20.15,3.35 19.21,4.29 19.21,16.51 22.41,19.72 U1.55
PD9
  Top 0.305: SODIMM1.51 20.75,3.54 19.68,4.6 19.68,16.19 22.71,19.22 U1.56
PD10
  Top 0.305: SODIMM1.53 21.35,3.73 20.16,4.92 20.16,15.88 23,18.72 U1.57
PD11
  Top 0.305: SODIMM1.55 21.95,3.93 20.64,5.24 20.64,15.56 23.3,18.22 U1.58
PD12
  Top 0.305: SODIMM1.57 22.55,4.12 21.11,5.56 21.11,15.24 23.59,17.72 U1.59
PD13
  Top 0.305: SODIMM1.59 23.15,4.31 21.59,5.87 21.59,14.92 23.88,17.22 U1.60
PD14
  Top 0.305: U1.61 24.18,16.72 22.07,14.61 22.07,6.19 23.75,4.51 SODIMM1.61
PD15
  Top 0.305: SODIMM1.63 24.35,4.7 22.54,6.51 22.54,14.29 24.47,16.22 U1.62
PE0
  Top 0.305: SODIMM1.121 41.75,6.03 40.85,6.93 U1.97
PE1
  Top 0.305: SODIMM1.123 42.35,6.23 41.35,7.22 U1.98
PE2
  Top 0.305: U1.1 44.89,9.72 45.35,9.26 SODIMM1.133
PE3
  Top 0.305: U1.2 45.19,10.22 45.95,9.45 SODIMM1.135
PE4
  Top 0.305: U1.3 45.48,10.72 46.55,9.65 SODIMM1.137
PE5
  Top 0.305: U1.4 45.77,11.22 47.15,9.84 SODIMM1.139
PE6
  Top 0.305: U1.5 46.07,11.72 47.75,10.04 SODIMM1.141
PE7
  Top 0.305: SODIMM1.19 7.55,17.87 19.84,30.16 33.81,30.16 36.35,27.62 U1.38
PE8
  Top 0.305: SODIMM1.21 8.15,17.68 20.16,29.69 33.5,29.69 35.85,27.33 U1.39
PE9
  Top 0.305: SODIMM1.23 8.75,17.48 20.48,29.21 33.18,29.21 35.35,27.04 U1.40
PE10
  Top 0.305: SODIMM1.25 9.35,17.29 20.8,28.73 32.86,28.73 34.85,26.74 U1.41
PE11
  Top 0.305: SODIMM1.27 9.95,17.09 21.11,28.26 32.54,28.26 34.35,26.45 U1.42
PE12
  Top 0.305: SODIMM1.29 10.55,16.9 21.43,27.78 32.23,27.78 33.85,26.15 U1.43
PE13
  Top 0.305: SODIMM1.31 11.15,16.71 21.75,27.3 31.91,27.3 33.35,25.86 U1.44
PE14
  Top 0.305: SODIMM1.33 11.75,16.51 22.07,26.83 31.59,26.83 32.85,25.57 U1.45
PE15
  Top 0.305: SODIMM1.35 12.35,16.32 22.38,26.35 31.27,26.35 32.35,25.27 U1.46
RESET  (via drill 0.38)
  Top 0.305: v44.45,22.54 45.4,23.18 49.53,23.18 49.86,22.85 U2.1 49.86,21.89 50.32,21.43 v52.39,21.43 | v42.23,16.19 42.25,16.22 U1.14 | v54.29,21.91 55.53,21.91 R2.1
  Bottom 0.305: v44.45,22.54 42.23,20.32 v42.23,16.19 | v52.39,21.43 53.82,21.43 v54.29,21.91
RST  (via drill 0.38)
  Top 0.305: v44.13,26.35 47.49,26.35 S1.4 51.74,27.28 | 51.75,25.12 U2.4 51.74,27.28 | 51.74,27.28 S1.3
  Bottom 0.305: SODIMM1.90 32.15,8.65 32.38,8.89 40.48,8.89 40.8,9.21 40.8,21.27 43.02,23.5 43.02,25.24 v44.13,26.35
USB_D_N  (via drill 0.3)
  Top 0.305: v31.75,12.28 31.75,12.13 30.16,12.13 arc45 29.96,12.22 U1.70
  Bottom 0.305: SODIMM1.74 27.35,2.75 arc-45 27.39,2.86 27.39,11.18 arc-90 28.35,12.13 31.75,12.13 v31.75,12.28
USB_D_P  (via drill 0.3)
  Top 0.305: v31.75,11.53 31.75,11.68 30,11.68 arc45 29.91,11.72 U1.71
  Bottom 0.305: SODIMM1.76 27.95,2.62 arc45 27.85,2.86 27.85,6.42 arc-90 28.1,6.67 arc90 28.42,6.99 arc90 28.1,7.3 arc-90 27.85,7.55 27.85,11.04 arc-90 28.48,11.68 31.75,11.68 v31.75,11.53
USB_ID  (via drill 0.3)
  Top 0.305: U1.69 30.81,12.72 v30.96,12.86
  Bottom 0.305: v30.96,12.86 27.78,12.86 26.75,11.83 SODIMM1.72
VSUP
  Top 0.406: SODIMM1.197 64.55,5.21 64.76,5.41 | 64.76,5.41 PTC1.2 65.15,5.81 SODIMM1.199 64.76,1.4 64.76,5.41

### Text on the board
tSilk: SODIMM CPU / Version 1
_tplace: * | * | * | *